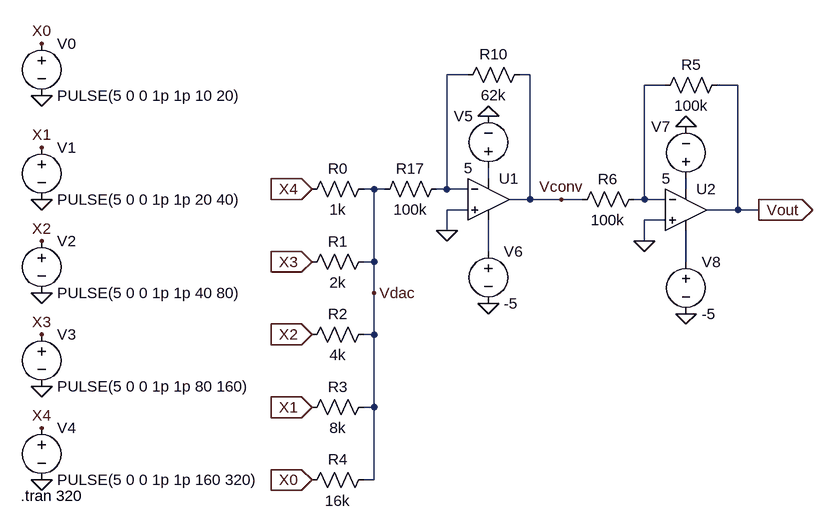
[diagram p0: schematic finalproject.asc]
finalproject.asc, the LTspice schematic file:
Version 4
SHEET 1 1744 900
WIRE 768 112 736 112
WIRE 864 112 848 112
WIRE 1072 128 1040 128
WIRE 1184 128 1152 128
WIRE 800 272 800 256
WIRE 624 288 608 288
WIRE 640 288 624 288
WIRE 736 288 736 112
WIRE 736 288 720 288
WIRE 768 288 736 288
WIRE 1104 288 1104 272
WIRE 864 304 864 112
WIRE 864 304 832 304
WIRE 912 304 864 304
WIRE 944 304 912 304
WIRE 1040 304 1040 128
WIRE 1040 304 1024 304
WIRE 1072 304 1040 304
WIRE 768 320 736 320
WIRE 1184 320 1184 128
WIRE 1184 320 1136 320
WIRE 1216 320 1184 320
WIRE 1072 336 1040 336
WIRE 736 352 736 320
WIRE 1040 368 1040 336
WIRE 800 384 800 336
WIRE 624 400 624 288
WIRE 624 400 608 400
WIRE 1104 400 1104 352
WIRE 624 448 624 400
WIRE 624 512 624 448
WIRE 624 512 608 512
WIRE 624 624 624 512
WIRE 624 624 608 624
WIRE 624 736 624 624
WIRE 624 736 608 736
FLAG 112 144 0
FLAG 112 304 0
FLAG 112 448 0
FLAG 112 592 0
FLAG 112 736 0
FLAG 112 64 X0
FLAG 112 224 X1
FLAG 112 368 X2
FLAG 112 512 X3
FLAG 112 656 X4
FLAG 528 288 X4
IOPIN 528 288 In
FLAG 528 400 X3
IOPIN 528 400 In
FLAG 528 512 X2
IOPIN 528 512 In
FLAG 528 624 X1
IOPIN 528 624 In
FLAG 528 736 X0
IOPIN 528 736 In
FLAG 800 176 0
FLAG 800 464 0
FLAG 736 352 0
FLAG 1216 320 Vout
IOPIN 1216 320 Out
FLAG 1104 192 0
FLAG 1104 480 0
FLAG 1040 368 0
FLAG 624 448 Vdac
FLAG 912 304 Vconv
SYMBOL voltage 112 208 R0
SYMATTR InstName V1
SYMATTR Value PULSE(5 0 0 1p 1p 20 40)
SYMBOL voltage 112 352 R0
SYMATTR InstName V2
SYMATTR Value PULSE(5 0 0 1p 1p 40 80)
SYMBOL voltage 112 496 R0
SYMATTR InstName V3
SYMATTR Value PULSE(5 0 0 1p 1p 80 160)
SYMBOL voltage 112 640 R0
SYMATTR InstName V4
SYMATTR Value PULSE(5 0 0 1p 1p 160 320)
SYMBOL voltage 112 48 R0
WINDOW 123 0 0 Left 2
WINDOW 39 0 0 Left 2
SYMATTR InstName V0
SYMATTR Value PULSE(5 0 0 1p 1p 10 20)
SYMBOL res 624 384 R90
WINDOW 0 0 56 VBottom 2
WINDOW 3 32 56 VTop 2
SYMATTR InstName R1
SYMATTR Value 2k
SYMATTR SpiceLine tol=0
SYMBOL res 624 496 R90
WINDOW 0 0 56 VBottom 2
WINDOW 3 32 56 VTop 2
SYMATTR InstName R2
SYMATTR Value 4k
SYMATTR SpiceLine tol=0
SYMBOL res 624 608 R90
WINDOW 0 0 56 VBottom 2
WINDOW 3 32 56 VTop 2
SYMATTR InstName R3
SYMATTR Value 8k
SYMATTR SpiceLine tol=0
SYMBOL res 624 720 R90
WINDOW 0 0 56 VBottom 2
WINDOW 3 32 56 VTop 2
SYMATTR InstName R4
SYMATTR Value 16k
SYMATTR SpiceLine tol=0
SYMBOL res 624 272 R90
WINDOW 0 0 56 VBottom 2
WINDOW 3 32 56 VTop 2
SYMATTR InstName R0
SYMATTR Value 1k
SYMATTR SpiceLine tol=0
SYMBOL res 864 96 R90
WINDOW 0 0 56 VBottom 2
WINDOW 3 32 56 VTop 2
SYMATTR InstName R10
SYMATTR Value 62k
SYMATTR SpiceLine tol=0
SYMBOL voltage 800 272 R180
WINDOW 0 24 96 Left 2
WINDOW 3 24 16 Left 2
WINDOW 123 0 0 Left 2
WINDOW 39 0 0 Left 2
SYMATTR InstName V5
SYMATTR Value 5
SYMBOL voltage 800 368 R0
WINDOW 123 0 0 Left 2
WINDOW 39 0 0 Left 2
SYMATTR InstName V6
SYMATTR Value -5
SYMBOL Opamps\\UniversalOpamp2 800 304 R0
SYMATTR InstName U1
SYMBOL res 736 272 R90
WINDOW 0 0 56 VBottom 2
WINDOW 3 32 56 VTop 2
SYMATTR InstName R17
SYMATTR Value 100k
SYMBOL res 1168 112 R90
WINDOW 0 0 56 VBottom 2
WINDOW 3 32 56 VTop 2
SYMATTR InstName R5
SYMATTR Value 100k
SYMATTR SpiceLine tol=0
SYMBOL voltage 1104 288 R180
WINDOW 0 24 96 Left 2
WINDOW 3 24 16 Left 2
WINDOW 123 0 0 Left 2
WINDOW 39 0 0 Left 2
SYMATTR InstName V7
SYMATTR Value 5
SYMBOL voltage 1104 384 R0
WINDOW 123 0 0 Left 2
WINDOW 39 0 0 Left 2
SYMATTR InstName V8
SYMATTR Value -5
SYMBOL Opamps\\UniversalOpamp2 1104 320 R0
SYMATTR InstName U2
SYMBOL res 1040 288 R90
WINDOW 0 0 56 VBottom 2
WINDOW 3 32 56 VTop 2
SYMATTR InstName R6
SYMATTR Value 100k
TEXT 80 760 Left 2 !.tran 320

The netlist it stands for:
* finalproject.asc
V1 X1 0 PULSE(5 0 0 1p 1p 20 40)
V2 X2 0 PULSE(5 0 0 1p 1p 40 80)
V3 X3 0 PULSE(5 0 0 1p 1p 80 160)
V4 X4 0 PULSE(5 0 0 1p 1p 160 320)
V0 X0 0 PULSE(5 0 0 1p 1p 10 20)
R1 Vdac X3 2k tol=0
R2 Vdac X2 4k tol=0
R3 Vdac X1 8k tol=0
R4 Vdac X0 16k tol=0
R0 Vdac X4 1k tol=0
R10 Vconv N001 62k tol=0
V5 N003 0 5
V6 N005 0 -5
XU1 0 N001 N003 N005 Vconv level.2 Avol=1Meg GBW=10Meg Slew=10Meg ilimit=25m rail=0 Vos=0 phimargin=45 en=0 enk=0 in=0 ink=0 Rin=500Meg  ; pins IN+ IN- V+ V- OUT
R17 N001 Vdac 100k
R5 Vout N002 100k tol=0
V7 N004 0 5
V8 N006 0 -5
XU2 0 N002 N004 N006 Vout level.2 Avol=1Meg GBW=10Meg Slew=10Meg ilimit=25m rail=0 Vos=0 phimargin=45 en=0 enk=0 in=0 ink=0 Rin=500Meg  ; pins IN+ IN- V+ V- OUT
R6 N002 Vconv 100k
.tran 320
.lib UniversalOpamps2.sub
.backanno
.end